# Altium schematic sheet Sheet1.SchDoc
size A3; SheetNumber: 1; SheetTotal: 2
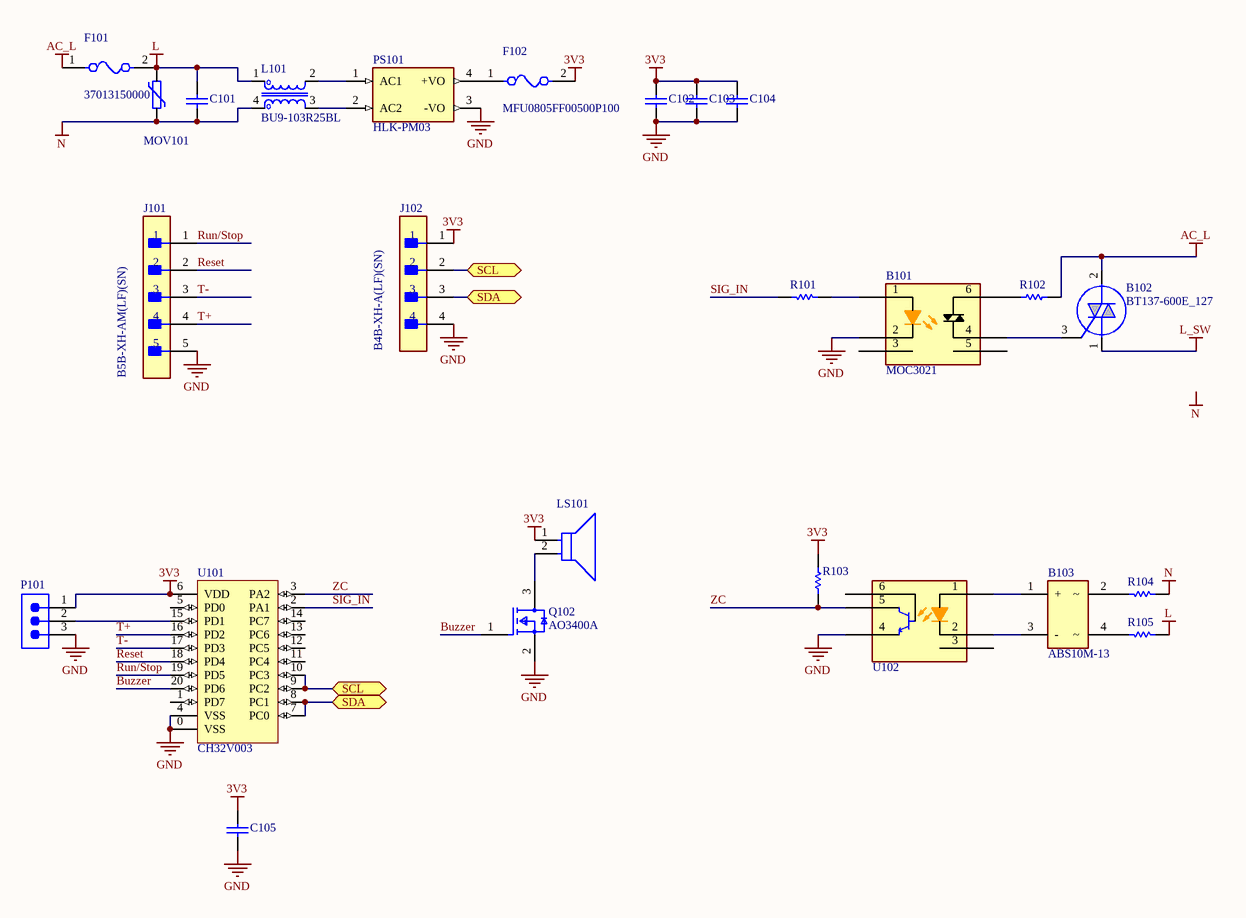
[diagram p0: Sheet1.SchDoc]

## Parts
B101  MOC3021  [MOC3021]
B102  BT137-600E_127  [TO254P470X1000X2000-3P]
B103  ABS10M-13  [SOP400P660X140-4N]
C101  890324023023  [WCAP-FTX2_L13W7H13]  (value not drawn)
C102  Capacitor  [CAPC2013X13N]  (value not drawn)
C103  Capacitor  [CAPC2013X13N]  (value not drawn)
C104  Capacitor  [CAPC2013X13N]  (value not drawn)
C105  Capacitor  [CAPC1608X09N]  (value not drawn)
F101  37013150000  [FP-370-MFG]
F102  MFU0805FF00500P100  [FP-MFU0805-MFG]
J101  B5B-XH-AM(LF)(SN)  [FP-B5B-XH-AM_LF_SN-MFG]
J102  B4B-XH-A(LF)(SN)  [FP-B4B-XH-A_LF_SN-MFG]
L101  BU9-103R25BL  [IND_BU9-103R25BL]
LS101  MCKPX-G1203A-K4056  [FP-MCKPX-G1203A-K4056-MFG]  (value not drawn)
MOV101  MOV  [MOV-10D561]  (value not drawn)
P101  61300311121  [61300311121]  (value not drawn)
PS101  HLK-PM03  [HLK-PM03]
Q102  AO3400A  [FP-SOT23-MFG]
R101  Resistor  [RESC1608X06N]  (value not drawn)
R102  Resistor 1/2W  [RESAD1650W60L650D250]  (value not drawn)
R103  Resistor  [RESC1608X06N]  (value not drawn)
R104  Resistor 1/2W  [RESAD1650W60L650D250]  (value not drawn)
R105  Resistor 1/2W  [RESAD1650W60L650D250]  (value not drawn)
U101  CH32V003  [QFN40P300X300X75_HS-21N]
U102  Optocoupler, Phototransistor Output, with Base Connection  [MOC3021]  (value not drawn)

## Ports
SCL (bidir, see Sheet1[2B], Sheet2[2C], Sheet2[3C]), SCL (bidir, see Sheet1[3A], Sheet2[2C], Sheet2[3C]), SDA (bidir, see Sheet1[2B], Sheet2[2C], Sheet2[3C]), SDA (bidir, see Sheet1[3A], Sheet2[2C], Sheet2[3C])

## Nets
3V3: C102.2 C103.2 C104.2 C105.2 F102.2 J102.1 LS101.1(C) P101.1 R103.2 U101.6(VDD)
AC_L: B102.2(MT2) F101.1 R102.2
GND: B101.2(CATHODE) C102.1 C103.1 C104.1 C105.1 J101.5 J102.4 P101.3 PS101.3(-VO) Q102.2(S) U101.0(VSS) U101.4(VSS) U102.4(MAIN_TERMINAL_1)
L: C101.2 F101.2 L101.1 MOV101.2 R105.1
L_SW: B102.1(MT1)
N: C101.1 L101.4 MOV101.1 R104.1
Buzzer: Q102.1(G) U101.20(PD6)
Reset: J101.2 U101.18(PD4)
Run/Stop: J101.1 U101.19(PD5)
SCL: J102.2 U101.9(PC2) U101.10(PC3) ; port SCL
SDA: J102.3 U101.7(PC0) U101.8(PC1) ; port SDA
SIG_IN: R101.2 U101.2(PA1)
T+: J101.4 U101.16(PD2)
T-: J101.3 U101.17(PD3)
ZC: R103.1 U101.3(PA2) U102.5(SUBSTRATE)
NetB101_1: B101.1(ANODE) R101.1
NetB101_4: B101.4(MAIN_TERMINAL_1) B102.3(G)
NetB101_6: B101.6(MAIN_TERMINAL_2) R102.1
NetB103_1: B103.1(+) U102.1(ANODE)
NetB103_2: B103.2 R104.2
NetB103_3: B103.3(-) U102.2(CATHODE)
NetB103_4: B103.4 R105.2
NetF102_1: F102.1 PS101.4(+VO)
NetL101_2: L101.2 PS101.1(AC1)
NetL101_3: L101.3 PS101.2(AC2)
NetLS101_2: LS101.2(A) Q102.3(D)
NetP101_2: P101.2 U101.15(PD1)

Not connected (* = marked no-connect by the designer): B101 3(NC) 5(SUBSTRATE); U101 1(PD7) 5(PD0) 11(PC4) 12(PC5) 13(PC6) 14(PC7); U102 3(NC) 6(MAIN_TERMINAL_2)

## Notes on the sheet
- Labels drawn without touching a wire or pin: N

## Library data of the parts
B101 = MOC3021: Optocoupler Triac Output, 400V, DIP6 Lite-On MOC3021 Triac Output Optocoupler, Through Hole, 6-Pin PDIP; Geometry.Height: 4.5mm; Manufacturer_Name: Lite-On; Manufacturer_Part_Number: MOC3021; Mouser Part Number: 859-MOC3021; Mouser Price/Stock: https://www.mouser.co.uk/ProductDetail/Lite-On/MOC3021?qs=%2F3Qg3%252BjSQfNbQyAt8MJ%2FPw%3D%3D; Arrow Part Number: MOC3021; Arrow Price/Stock: https://www.arrow.com/en/products/moc3021/lite-on-technology?region=nac; Datasheet Link: https://datasheet.datasheetarchive.com/originals/distributors/Datasheets-17/DSA-323139.pdf
B102 = BT137-600E_127: BT137-600E,127 8A, 600V, TRIAC, Gate Trigger 1.5V 25mA, 3-pin, Through Hole, TO-220AB WeEn Semiconductors Co., Ltd; Geometry.Height: 4.7mm; Manufacturer_Name: WeEn Semiconductors; Manufacturer_Part_Number: BT137-600E,127; Mouser Part Number: 771-BT137-600E; Mouser Price/Stock: https://www.mouser.co.uk/ProductDetail/WeEn-Semiconductors/BT137-600E127?qs=me8TqzrmIYUZpSeuBf3dRg%3D%3D; Arrow Part Number: BT137-600E,127; Arrow Price/Stock: https://www.arrow.com/en/products/bt137-600e127/ween-semiconductors?region=europe; Datasheet Link: http://www.ween-semi.com/sites/default/files/2018-10/bt137-600e.pdf
B103 = ABS10M-13: Bridge Rectifier Single Phase Standard 1 kV Surface Mount 4-SOPA (Type WX); Manufacturer_Name: Diodes Incorporated; Geometry.Height: 1.4mm; Manufacturer_Part_Number: ABS10M-13; Mouser Part Number: 621-ABS10M-13; Mouser Price/Stock: https://www.mouser.co.uk/ProductDetail/Diodes-Incorporated/ABS10M-13?qs=Li%252BoUPsLEnu%252B%252BQgAw9E2FA%3D%3D; Arrow Part Number: ABS10M-13; Arrow Price/Stock: https://www.arrow.com/en/products/abs10m-13/diodes-incorporated?region=nac; Datasheet Link: https://www.diodes.com//assets/Datasheets/ABS10M.pdf
C101 = CMP-03913-52220322-2: 890324023023 Film Capacitor, Wcap-Ftx2 Series, 0.1 F, 10%, Pp (Polypropylene), 275 Vac Rohs Compliant: Yes; Hole Diameter: 900µm; Voltage Rating (AC): 275V; Pin Length: 18mm; Capacitance: 100nF; Insulation Resistance: 30GΩ; Pitch: 10mm; Dielectric: PP; Case/Package: Radial; NexarPartId: 52220322; Max Operating Temperature: 105°C; Mount: Through Hole; REACH SVHC: Unknown; Termination: PC Pins; Length: 13mm; Min Operating Temperature: -40°C; Dielectric Material: PP; Lead Pitch: 10.0076mm; Tolerance: 10%; Voltage Rating: 275V; Height: 13mm; RoHS: Compliant; Height - Seated (Max): 13.4874mm; Voltage Rating (DC): 275V; Packaging: Bulk; Width: 7mm
C102-C104 = C0805: Value: 1p; Dielectric: *; Voltage: *
C105 = C0603: Value: 1p; Voltage: *; Dielectric: *
F101 = CMP-08605-000108-1: FUSE BRD MNT 3.15A 250VAC RADIAL; Voltage Rating (DC): 250V; Approvals: VDE; Fuse Type: Board Mount (Cartridge Style Excluded); Color: Brown; Power Dissipation: 950mW; Max Operating Temperature: 85°C; Series: TR5® 370; Mount: Through Hole; Fuse Current: 3.15A; Packaging: Ammo Pack; Number of Pins: 2; Case/Package: Radial; Termination: Radial; Radiation Hardening: No; RoHS Compliant: Yes; Lead Free: Lead Free; Length: 8mm; Diameter: 8.5mm; Current Rating: 3.15A; Height: 0.315inch; Min Operating Temperature: -40°C; Flammability Rating: UL94 V-0; Package Quantity: 1000; Voltage Rating (AC): 250V
F102 = CMP-00030-39591236-1: MFU0805FF00500P100 Fuse Chip Very Fast Acting 0.5A 32V SMD Solder Pad 0805 Ceramic T/R Automotive UL; Current Rating: 500mA; Resistance: 570mΩ; Radiation Hardening: No; Case Code (Imperial): 0805; Length: 2.0066mm; RoHS: Compliant; Case/Package: SMD/SMT; Max Operating Temperature: 125°C; Case Code (Metric): 2012; Housing Material: Ceramic; Height: 457.2µm; Width: 1.2446mm; NexarPartId: 39591236; Min Operating Temperature: -55°C; Approvals: UL; Lead Free: Lead Free; Depth: 1.25mm; Number of Pins: 2; REACH SVHC: No SVHC; Working Voltage: 32V; Voltage Rating (DC): 32V; Mount: Surface Mount; Packaging: Digi-Reel®; Fuse Current: 500mA
J101 = CMP-17439-000304-1: CONN HEADER VERT 5POS 2.5MM; Mated Stacking Heights: 9.8mm; Voltage Rating: 250V; Max Current Rating: 3A; Number of Positions: 5; Contact Resistance: 20mR; Depth: 5.75mm; Connector Type: Header; Color: Green; Insulation Material: Nylon; Contact Plating: Copper; Length: 14.9mm; Fastening Type: Detent; Contact Material: Brass; Number of Rows: 1; Contact Type: Male Pin; Housing Material: Polyamide; Housing Color: White; Lead Free: Lead Free; Max Voltage Rating (AC): 250V; Mount: Through Hole; Contact Shape: Square; Min Operating Temperature: -25°C; Packaging: Bulk; Orientation: Straight; Insulation Color: Natural; Series: XH; Flammability Rating: UL94 V-0; Contact Finish - Mating: TIN; Max Operating Temperature: 85°C; Termination: Solder; Pitch: 2.5mm
J102 = CMP-17439-000250-1: CONN HEADER VERT 4POS 2.5MM; Number of Contacts: 4; Contact Resistance: 20mR; Voltage Rating: 250V; Max Current Rating: 3A; Gender: Male; Wire/Cable Gauge: 22AWG; Mated Stacking Heights: 9.8mm; Insulation Resistance: 1GR; Orientation: Straight; Contact Type: Male Pin; Contact Finish - Mating: TIN; Series: XH; Max Voltage Rating (AC): 250V; Lead Pitch: 2.5mm; Contact Shape: Square; Insulation Color: Natural; Termination: Solder; Lead Free: Lead Free; Voltage Rating (AC): 250V; Number of Rows: 1; Flammability Rating: UL94 V-0; Number of Positions: 4; Max Operating Temperature: 85°C; Package Quantity: 500; Mount: Through Hole; REACH SVHC: No SVHC; Connector Type: Header; Insulation Material: Nylon; Fastening Type: Detent; Min Operating Temperature: -25°C; Housing Color: White; Packaging: Bulk; Contact Plating: Tin; Contact Material: Brass; Max Voltage Rating (DC): 250V; Housing Material: Polyamide; Color: Natural; Material: Polyamide; Pitch: 2.5mm; Depth: 5.75mm; Current Rating: 3A; Length: 12.4mm
L101 = BU9-103R25BL: Common mode choke, power line, RoHS; Package: None; Value: *; Availability: Unavailable; MP: BU9-103R25BL; Price: None
LS101 = CMP-12433-000001-1: MAGNETIC BUZZER AND TRANSDUCER - More Details; Manufacturer: Multicomp Pro; Operating Supply Voltage: 3V; Current: 30mA; Frequency: 2300Hz; Max Supply Voltage: 5V; Min Supply Voltage: 2V; Standoff Height: 0.5mm; ComponentLink2Description: Datasheet; ComponentLink2URL: http://www.farnell.com/datasheets/1498149.pdf?_ga=2.17855225.1157923166.1572356775-536200964.1569240579; Manufacturer Part Number: MCKPX-G1203A-K4056; Temperature Range High: +70°C; Device Class L2: Audio Products; Temperature Range Low: -20°C; Package: 0; Temperature: -20°C to +70°C; Category: Speak; Octopart: https://octopart.com/mckpx-g1203a-k4056-multicomp-12157154; RoHS: TRUE; Lead Free: Yes; Height: 9.5mm; Device Class L1: Electromechanical; Automotive: No; Device Class L3: Buzzers
P101 = CMP-1502-01062-3: NexarPartId: 32855521; Current Rating: 3A; Voltage Rating: 250V; Number of Positions: 3; Pitch: 2.54mm; Contact Resistance: 20mΩ; Connector Type: Male Pin; Gender: Male; REACH SVHC: Unknown; Packaging: Bulk; Contact Material: Copper; Min Operating Temperature: -40°C; Number of Rows: 1; Orientation: Vertical; RoHS: Compliant; Contact Plating: Gold; Max Operating Temperature: 105°C; Mount: Through Hole; Height: 8.94mm; Operating Supply Voltage: 250V; Number of Pins: 3; Contact Mating Length: 5.9944mm; Number of Contacts: 3; Color: Black; Lead Free: Lead Free; Lead Pitch: 2.54mm; Termination: Solder
PS101 = HLK-PM03: MF: Hi-link; Availability: Not in stock; SnapEDA_Link: https://www.snapeda.com/parts/HLK-PM03/Hi-link/view-part/?ref=snap; Price: None; MP: HLK-PM03; Package: Package; Check_prices: https://www.snapeda.com/parts/HLK-PM03/Hi-link/view-part/?ref=eda; Value: *
Q102 = CMP-83955-000006-1: MOSFET N-CH 30V 5.7A SOT23; Input Capacitance: 630pF; Number of Elements: 1; Rds On Max: 26.5mR; Max Power Dissipation: 1.4W; Gate to Source Voltage (Vgs): 12V; Min Operating Temperature: -55°C; Lead Free: Lead Free; Number of Pins: 3; Drain to Source Voltage (Vdss): 30V; Case/Package: SOT-23; Mount: Surface Mount; Continuous Drain Current (ID): 5.7A; Radiation Hardening: No; Packaging: Tape and Reel; Max Operating Temperature: 150°C; Power Dissipation: 1.4W
R101 R103 = R0603: Value: *
R102 = R_DIP: Resistor; Value: *
R104 R105 = R_DIP: 30k; Value: *
U101 = CH32V003F4U6: CH32V003 series is an industrial-grade general-purpose microcontroller designed based on QingKe RISC-V2A / core, which supports 48MHz system main frequency in the product function
U102 = 4N25